# EAGLE schematic AutomaticPlantWatering (EAGLE 7.1.0)
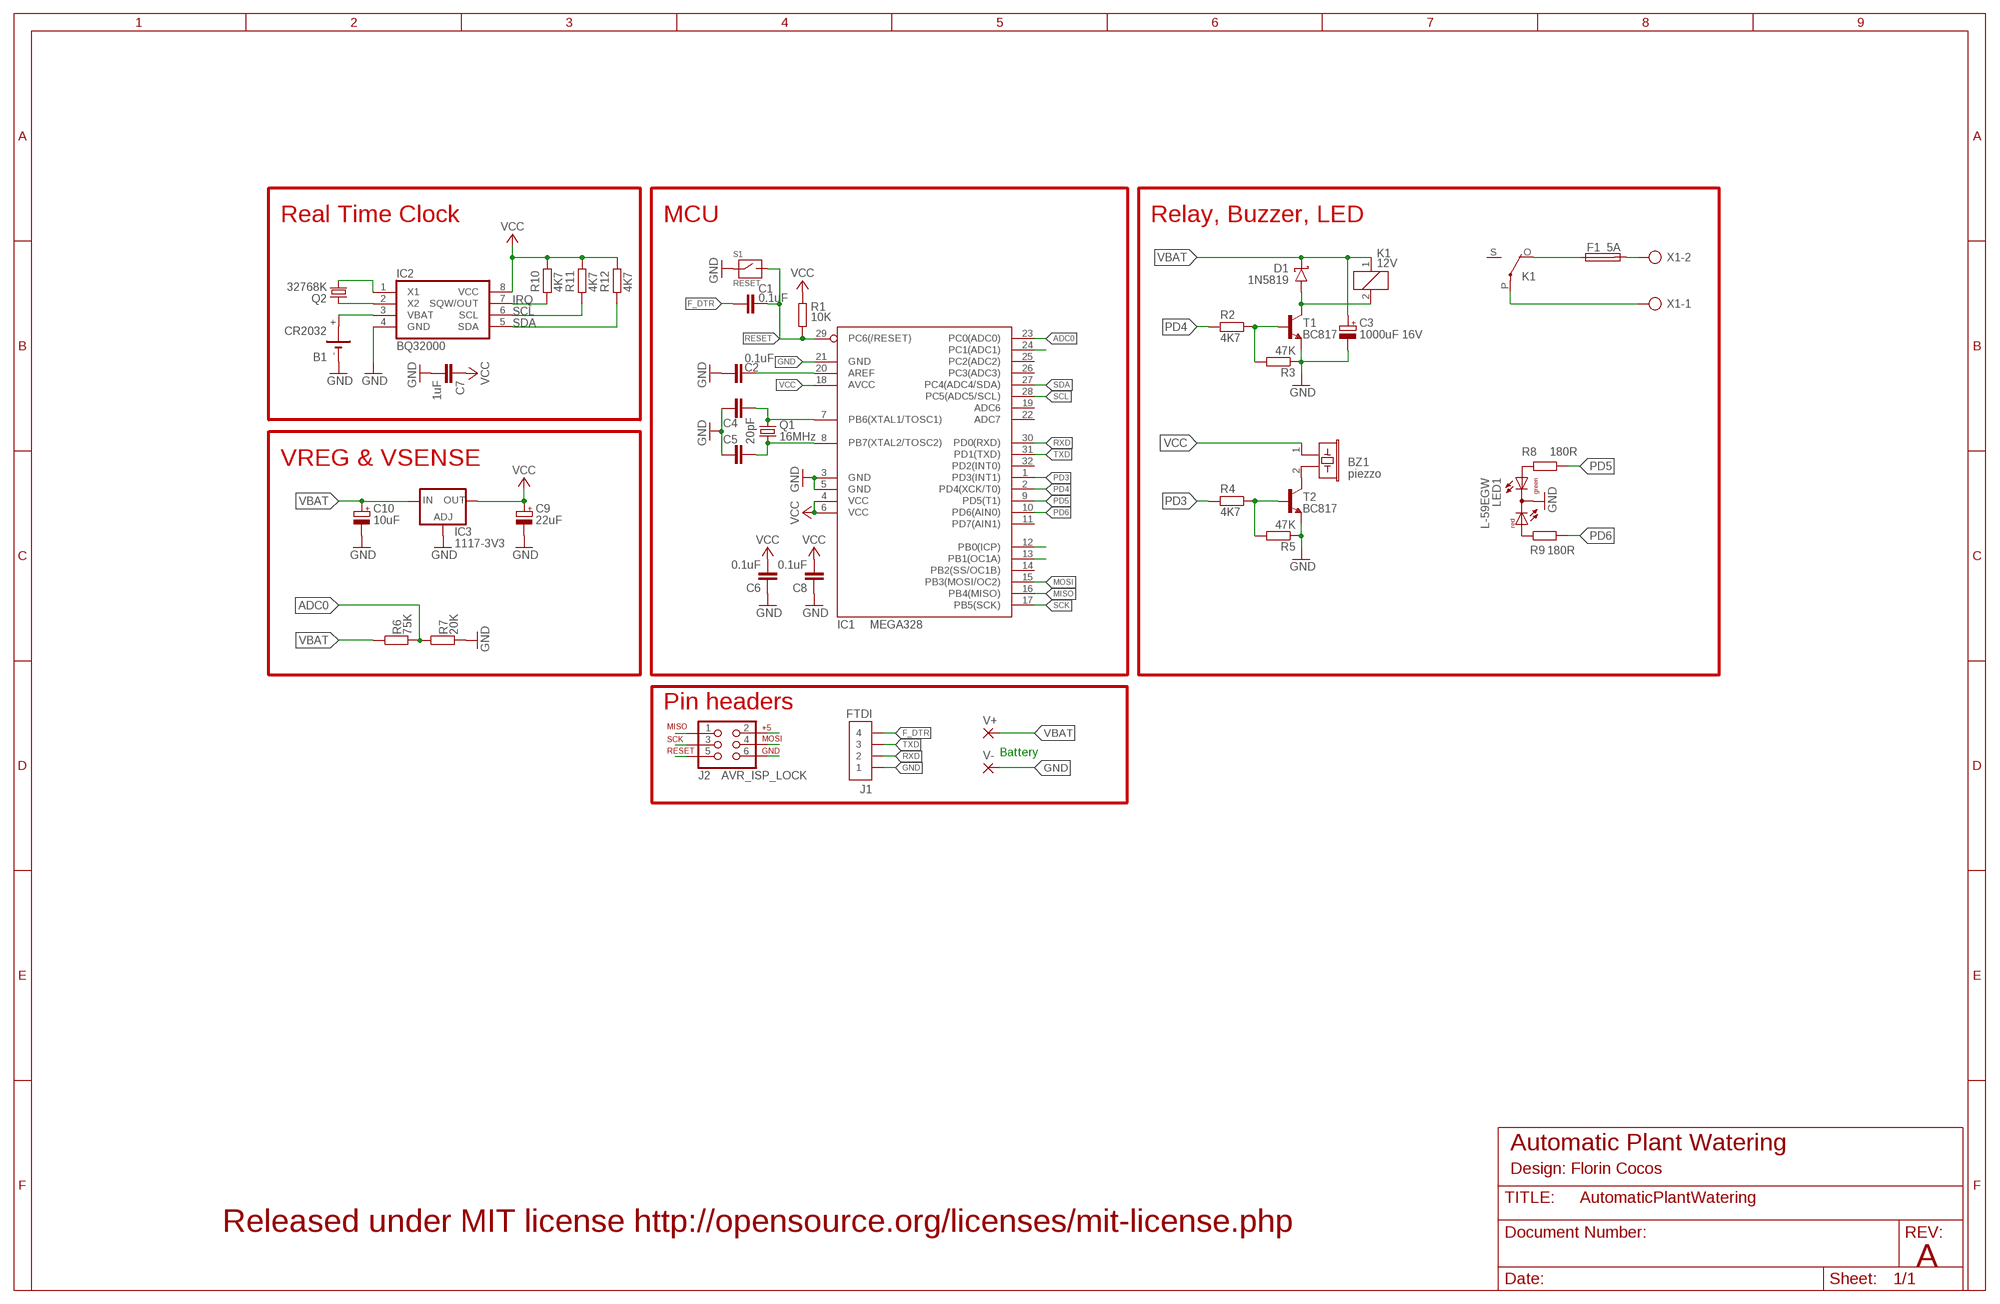
[diagram p0: schematic, sheet 1]

## Parts
B1  CR2032  CR2032H  [CR2032H]
BZ1  piezzo  EFBAA40D101  [EFBAA40D101]
C1  0.1uF  C-EUC0805  [C0805]
C2  0.1uF  C-EUC0805  [C0805]
C3  1000uF 16V  CAPACITOR-CPOL-5.5X10.5  [CPOL-5.5X10.5]
C4  20pF  C-EUC0805  [C0805]
C5  20pF  C-EUC0805  [C0805]
C6  0.1uF  C-EUC0805  [C0805]
C7  1uF  C-EUC0805  [C0805]
C8  0.1uF  C-EUC0805  [C0805]
C9  22uF  CAPACITOR-CPOL-5.5X10.5  [CPOL-5.5X10.5]
C10  10uF  CAPACITOR-CPOL-5.5X10.5  [CPOL-5.5X10.5]
D1  1N5819  DIODE-SCHOTTKY-SMA  [SMA]
F1  5A  FUSESH22,5A  [SH22,5A]
IC1  MEGA328  MEGA8-AI  [TQFP32-08]
IC2  BQ32000  IC_RTC_DS1307  [SO-8]
IC3  1117-3V3  LD117AS12TR  [SOT223]
J1  FTDI  1X4_LOCK  [1X4_LOCK]
J2  AVR_ISP_LOCK  [2X3_LOCK]
K1  12V  ZF112  [ZF112]
LED1  L-59EGW  DUOLED-RG-C  [DUOLED-C-5MM]
Q1  16MHz  CRYSTALSM49  [SM49]
Q2  32768K  CRYSTALSM49  [SM49]
R1  10K  R-EU_R0805  [R0805]
R2  4K7  R-EU_R0805  [R0805]
R3  47K  R-EU_R0805  [R0805]
R4  4K7  R-EU_R0805  [R0805]
R5  47K  R-EU_R0805  [R0805]
R6  75K  R-EU_R0805  [R0805]
R7  20K  R-EU_R0805  [R0805]
R8  180R  R-EU_R0805  [R0805]
R9  180R  R-EU_R0805  [R0805]
R10  4K7  R-EU_R0805  [R0805]
R11  4K7  R-EU_R0805  [R0805]
R12  4K7  R-EU_R0805  [R0805]
S1  RESET  SWITCH-SMT  [SWITCH-SMT-3.7X6.2]
T1  BC817  BC817-40-NPN-SOT23-BEC  [SOT23-BEC]
T2  BC817  BC817-40-NPN-SOT23-BEC  [SOT23-BEC]
V+  SMD5  [SMD2,54-5,08]
V-  SMD5  [SMD2,54-5,08]
X1  AK500/2  [AK500/2]

## Nets
ADC0: IC1.23(PC0(ADC0)) R6.2 R7.1
F_DTR: C1.1 J1.4
FUSE-IN: F1.1 K1.O(2:O)
GND: B1.- C2.1 C3.N(NEGATIVE) C4.1 C5.1 C6.1 C7.2 C8.1 C9.N(NEGATIVE) C10.N(NEGATIVE) IC1.3(GND) IC1.5(GND) IC1.21(GND) IC2.4(GND) IC3.1(ADJ) J1.1 J2.6 LED1.C R3.1 R5.1 R7.2 S1.1 T1.E T2.E V-.1(P)
IRQ: IC2.7(SQW/OUT) R10.2
MISO: IC1.16(PB4(MISO)) J2.1
MOSI: IC1.15(PB3(MOSI/OC2)) J2.4
N$1: R2.1 R3.2 T1.B
N$2: LED1.AX(AG) R8.2
N$3: LED1.AR R9.1
N$4: R4.1 R5.2 T2.B
N$5: BZ1.2 T2.C
N$6: C2.2 IC1.20(AREF)
N$7: IC2.1(X1) Q2.2
N$8: C4.2 IC1.7(PB6(XTAL1/TOSC1)) Q1.1
N$9: C5.2 IC1.8(PB7(XTAL2/TOSC2)) Q1.2
N$10: IC2.2(X2) Q2.1
N$11: B1.+ IC2.3(VBAT)
N$21: D1.A K1.2 T1.C
N$22: F1.2 X1.2
PB0: IC1.12(PB0(ICP))
PB1: IC1.13(PB1(OC1A))
PC1: IC1.24(PC1(ADC1))
PD3: IC1.1(PD3(INT1)) R4.2
PD4: IC1.2(PD4(XCK/T0)) R2.2
PD5: IC1.9(PD5(T1)) R8.1
PD6: IC1.10(PD6(AIN0)) R9.2
RELAY-IN: K1.P(2:P) X1.1
RESET: C1.2 IC1.29(PC6(/RESET)) J2.5 R1.1 S1.2
RXD: IC1.30(PD0(RXD)) J1.2
SCK: IC1.17(PB5(SCK)) J2.3
SCL: IC1.28(PC5(ADC5/SCL)) IC2.6(SCL) R11.2
SDA: IC1.27(PC4(ADC4/SDA)) IC2.5(SDA) R12.2
TXD: IC1.31(PD1(TXD)) J1.3
VBAT: C3.P(POSITIVE) C10.P(POSITIVE) D1.K IC3.3(IN) K1.1 R6.1 V+.1(P)
VCC: BZ1.1 C6.2 C7.1 C8.2 C9.P(POSITIVE) IC1.4(VCC) IC1.6(VCC) IC1.18(AVCC) IC2.8(VCC) IC3.4(OUT) J2.2 R1.2 R10.1 R11.1 R12.1
Unconnected: B1.+@1(+) IC1.11(PD7(AIN1)) IC1.14(PB2(SS/OC1B)) IC1.19(ADC6) IC1.22(ADC7) IC1.25(PC2(ADC2)) IC1.26(PC3(ADC3)) IC1.32(PD2(INT0)) K1.S(2:S)

## Notes on the sheet
- Real Time Clock | MCU | Relay, Buzzer, LED
- VREG & VSENSE
- Pin headers
- Battery
- Automatic Plant Watering
- Design: Florin Cocos
- Released under MIT license http://opensource.org/licenses/mit-license.php
- A

## Library data of the parts
B1 = battery:CR2032H: LI BATTERY Varta
BZ1 = buzzer:EFB?: Piezoelectric Acoustic Transducer Source: Panbasonic .. 2SC1685.pdf
C1 C2 C4-C8 = rcl:C-EU: CAPACITOR, European symbol
C3 C9 C10 = Youritronics:CAPACITOR
D1 = Youritronics:DIODE-SCHOTTKY
F1 = fuse:FUSE: Fuse
IC1 = atmel:MEGA8: MICROCONTROLLER 8 Kbytes FLASH, 1 kbytes SRAM, 512 bytes EEPROM, USART, 6-channel 10 bit ADC, 2-channel 8 bit ADC Pin compatible with Atmega48, ATMega88, ATMega168 Source: avr.lbr
IC2 = dp_devices:IC_RTC_DS1307
IC3 = v-reg:LD117A?*: Low drop fixed and adjustable positive voltage regulators 1 A Source: http://www.st.com/stonline/products/literature/ds/7194/ld1117axx.pdf
J1 = Youritronics:1X4_LOCK
J2 = Youritronics:AVR_ISP_LOCK: This AVR ISP connector has a 2x3 lock header.
K1 = relay:ZF112: RELAY 1 x switch
LED1 = led:DUOLED-RG-C: DUO LED 2 colors (red/green), 5 mm, round, common Cathode www.ligitek.com or other producers.
Q1 Q2 = crystal:CRYSTAL: CRYSTAL
R1-R12 = rcl:R-EU_: RESISTOR, European symbol
S1 = Youritronics:SWITCH-SMT
T1 T2 = transistor:*-NPN-: NPN Transistror BF959 corrected 2008.03.06
V+ V- = wirepad:SMD5: SMD PAD
X1 = con-ptr500:AK500/2: CONNECTOR

## Net classes
1 50ohm: width 0.93 mm, clearance 0.2 mm to class 0